# EAGLE design nucleo_controller (EAGLE 9.4.2)

## Sheet 1 of 2
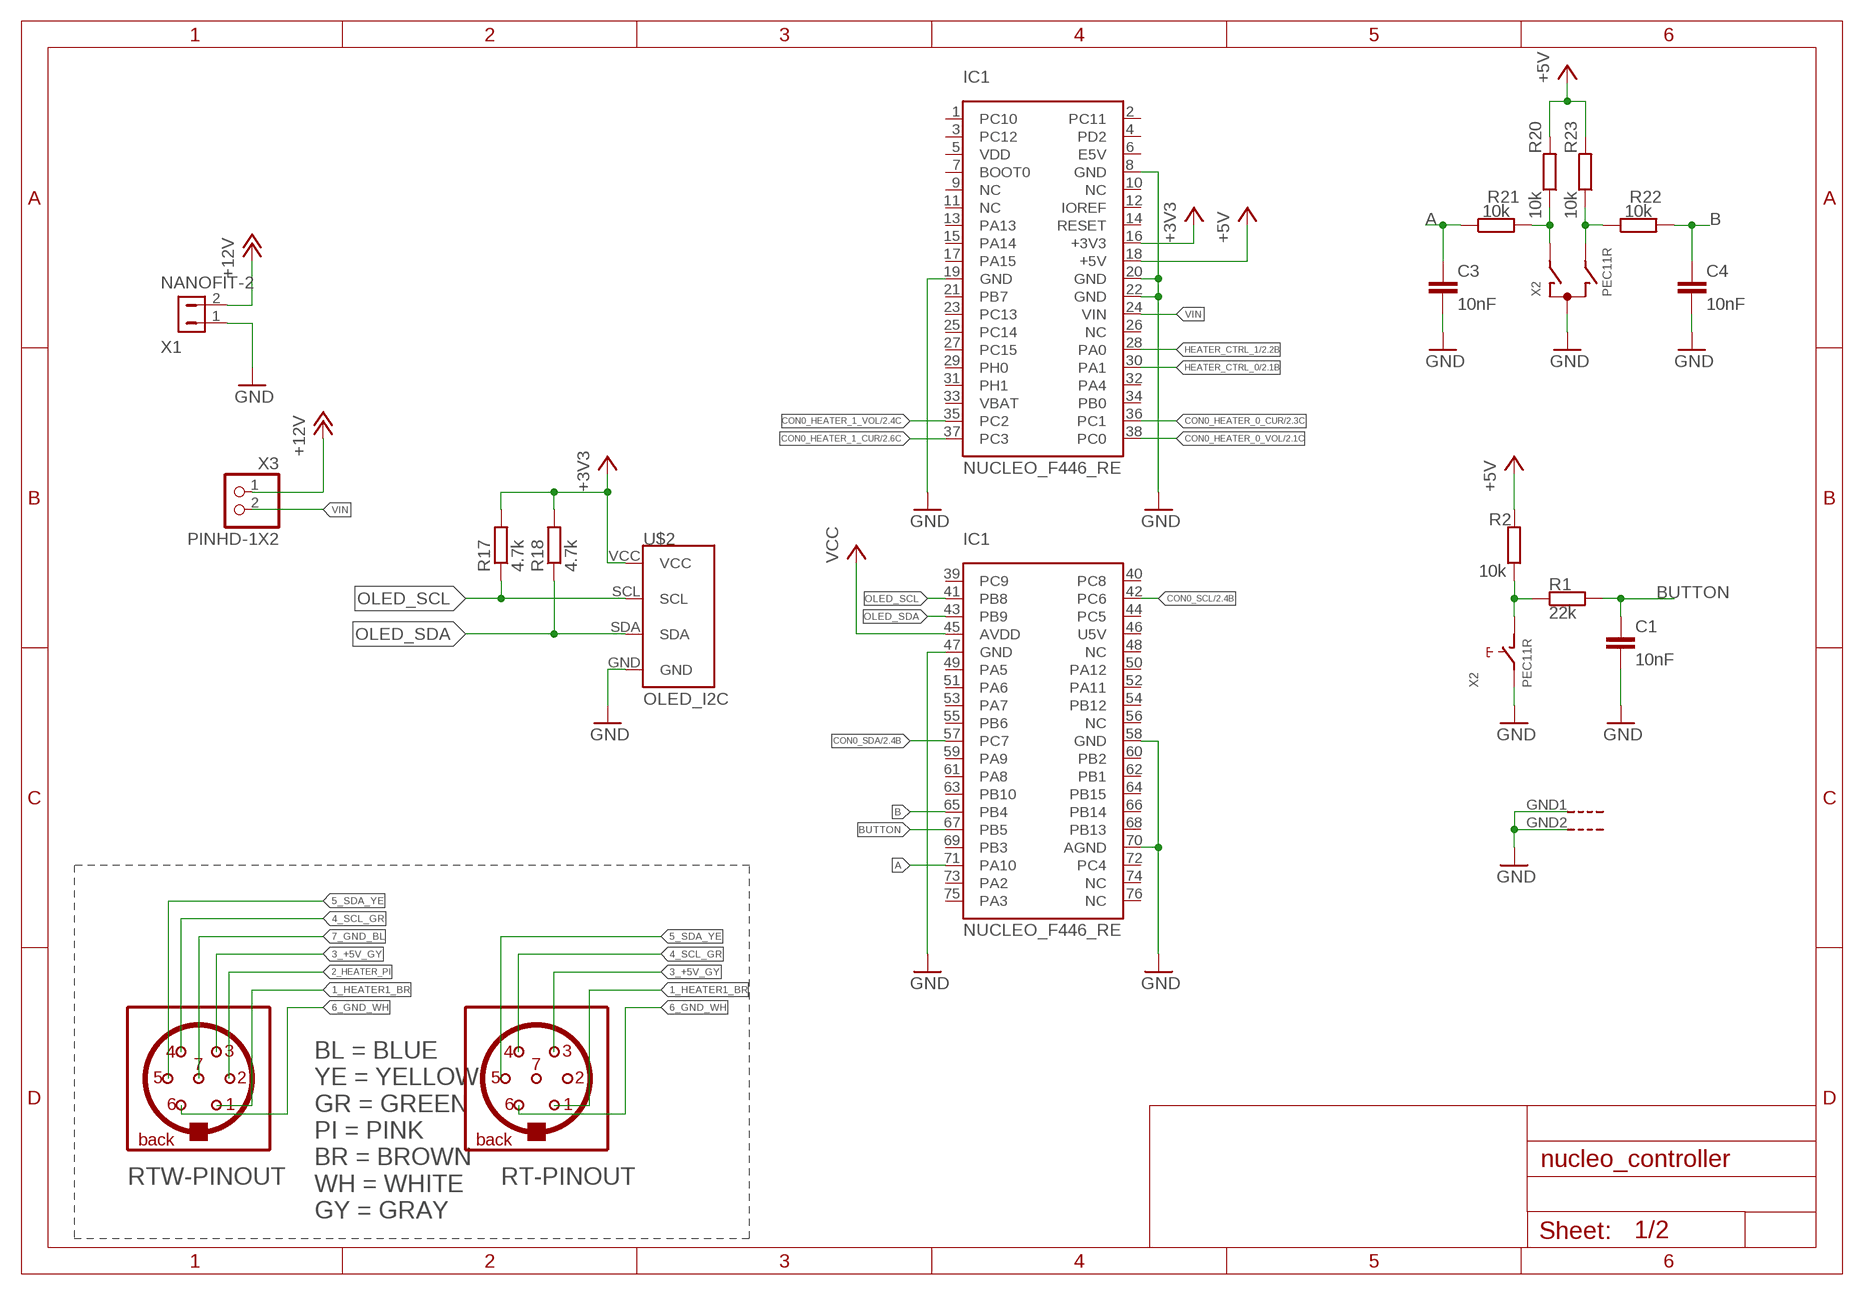
[diagram p0: schematic, sheet 1]

### Parts
C1  10nF  C-EUC0805  [C0805]
C3  10nF  C-EUC0805  [C0805]
C4  10nF  C-EUC0805  [C0805]
CON1  BINDER-IP40  (no package)
CON2  BINDER-IP40  (no package)
IC1  NUCLEO_F446_RE  [NUCLEO_F446_RE]
R1  22k  R-EU_R0805  [R0805]
R2  10k  R-EU_R0805  [R0805]
R17  4.7k  R-EU_R0603  [R0603]
R18  4.7k  R-EU_R0603  [R0603]
R20  10k  R-EU_R0805  [R0805]
R21  10k  R-EU_R0805  [R0805]
R22  10k  R-EU_R0805  [R0805]
R23  10k  R-EU_R0805  [R0805]
U$2  OLED_I2C  [OLED_I2C]
X1  NANOFIT-2  [NANOFIT-2-90]
X2  PEC11R  [PEC11R]
X3  PINHD-1X2  [1X02]

### Nets
1_HEATER1_BR: CON1.P$4 CON2.P$4
2_HEATER_PI: CON1.P$2
3_+5V_GY: CON1.P$3 CON2.P$3
4_SCL_GR: CON1.P$6 CON2.P$6
5_SDA_YE: CON1.P$7
6_GND_WH: CON1.P$5 CON2.P$5
7_GND_BL: CON1.P$1
+3V3: IC1.16(+3V3) R17.2 R18.2 U$2.VCC
+5V: IC1.18(+5V) R2.2 R20.2 R23.2 ; also sheet 2
+12V: X1.2 X3.1 ; also sheet 2
A: C3.1 IC1.71(PA10) R21.1
A_UNFIL: R20.1 R21.2 X2.A
B: C4.1 IC1.65(PB4) R22.2
B_UNFIL: R22.1 R23.1 X2.B
BUTTON: C1.1 IC1.67(PB5) R1.2
BUTTON_UNFIL: R1.1 R2.1 X2.D
CON0_HEATER_0_CUR: IC1.36(PC1) ; also sheet 2
CON0_HEATER_0_VOL: IC1.38(PC0) ; also sheet 2
CON0_HEATER_1_CUR: IC1.37(PC3) ; also sheet 2
CON0_HEATER_1_VOL: IC1.35(PC2) ; also sheet 2
CON0_SCL: IC1.42(PC6) ; also sheet 2
CON0_SDA: IC1.57(PC7) ; also sheet 2
GND: C1.2 C3.2 C4.2 IC1.8(GND) IC1.19(GND) IC1.20(GND) IC1.22(GND) IC1.47(GND) IC1.58(GND) IC1.70(AGND) U$2.GND X1.1 X2.C X2.E X2.GND1(G) X2.GND2(G) ; also sheet 2
HEATER_CTRL_0: IC1.30(PA1) ; also sheet 2
HEATER_CTRL_1: IC1.28(PA0) ; also sheet 2
OLED_SCL: IC1.41(PB8) R17.1 U$2.SCL
OLED_SDA: IC1.43(PB9) R18.1 U$2.SDA
VCC: IC1.45(AVDD) ; also sheet 2
VIN: IC1.24(VIN) X3.2
Unconnected: CON2.P$1 CON2.P$2 CON2.P$7 IC1.1(PC10) IC1.2(PC11) IC1.3(PC12) IC1.4(PD2) IC1.5(VDD) IC1.6(E5V) IC1.7(BOOT0) IC1.9(NC) IC1.10(NC) IC1.11(NC) IC1.12(IOREF) IC1.13(PA13) IC1.14(RESET) IC1.15(PA14) IC1.17(PA15) IC1.21(PB7) IC1.23(PC13) IC1.25(PC14) IC1.26(NC) IC1.27(PC15) IC1.29(PH0) IC1.31(PH1) IC1.32(PA4) IC1.33(VBAT) IC1.34(PB0) IC1.39(PC9) IC1.40(PC8) IC1.44(PC5) IC1.46(U5V) IC1.48(NC) IC1.49(PA5) IC1.50(PA12) IC1.51(PA6) IC1.52(PA11) IC1.53(PA7) IC1.54(PB12) IC1.55(PB6) IC1.56(NC) IC1.59(PA9) IC1.60(PB2) IC1.61(PA8) IC1.62(PB1) IC1.63(PB10) IC1.64(PB15) IC1.66(PB14) IC1.68(PB13) IC1.69(PB3) IC1.72(PC4) IC1.73(PA2) IC1.74(NC) IC1.75(PA3) IC1.76(NC)

### Notes on the sheet
- BL = BLUE
  YE = YELLOW
  GR = GREEN
  PI = PINK
  BR = BROWN
  WH = WHITE
  GY = GRAY
- RTW-PINOUT | RT-PINOUT

## Sheet 2 of 2
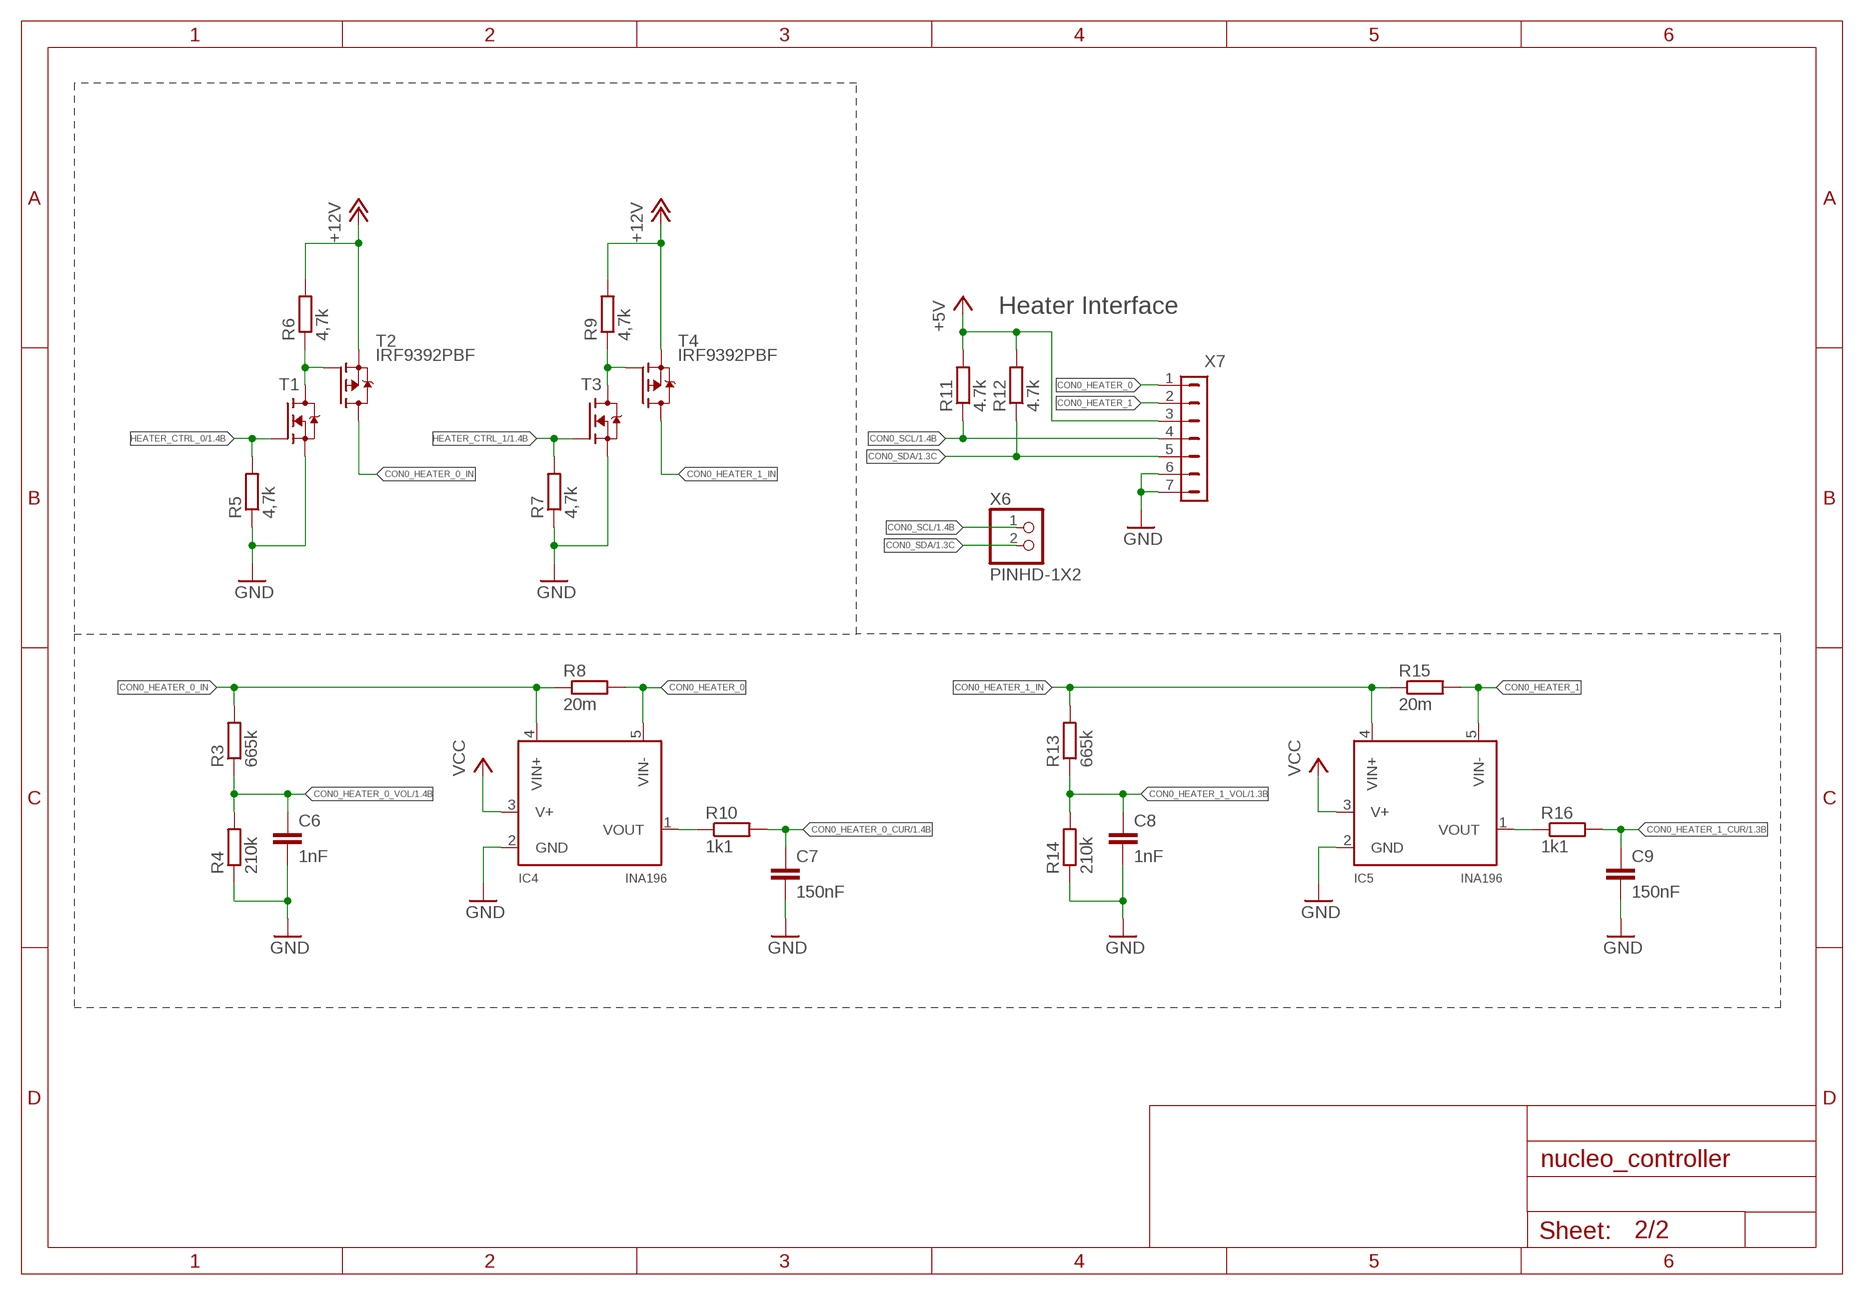
[diagram p1: schematic, sheet 2]

### Parts
C6  1nF  C-EUC0603  [C0603]
C7  150nF  C-EUC0603  [C0603]
C8  1nF  C-EUC0603  [C0603]
C9  150nF  C-EUC0603  [C0603]
IC4  INA196  [SOT23-5L]
IC5  INA196  [SOT23-5L]
R3  665k  R-EU_R0603  [R0603]
R4  210k  R-EU_R0603  [R0603]
R5  4,7k  R-EU_R0805  [R0805]
R6  4,7k  R-EU_R0805  [R0805]
R7  4,7k  R-EU_R0805  [R0805]
R8  20m  R-EU_R1206  [R1206]
R9  4,7k  R-EU_R0805  [R0805]
R10  1k1  R-EU_R0603  [R0603]
R11  4.7k  R-EU_R0603  [R0603]
R12  4.7k  R-EU_R0603  [R0603]
R13  665k  R-EU_R0603  [R0603]
R14  210k  R-EU_R0603  [R0603]
R15  20m  R-EU_R1206  [R1206]
R16  1k1  R-EU_R0603  [R0603]
T1  NVR4003NT3G  [SOT23]
T2  IRF9392PBF  [SO8]
T3  NVR4003NT3G  [SOT23]
T4  IRF9392PBF  [SO8]
X6  PINHD-1X2  [1X02]
X7  NANOFIT-7  [NANOFIT-7]

### Nets
+5V: R11.2 R12.2 X7.3 ; also sheet 1
+12V: R6.2 R9.2 T2.1(S) T2.2(S) T2.3(S) T4.1(S) T4.2(S) T4.3(S) ; also sheet 1
CON0_HEATER_0: IC4.5(VIN-) R8.2 X7.1
CON0_HEATER_0_CUR: C7.1 R10.2 ; also sheet 1
CON0_HEATER_0_IN: IC4.4(VIN+) R3.2 R8.1 T2.5(D) T2.6(D) T2.7(D) T2.8(D)
CON0_HEATER_0_VOL: C6.1 R3.1 R4.2 ; also sheet 1
CON0_HEATER_1: IC5.5(VIN-) R15.2 X7.2
CON0_HEATER_1_CUR: C9.1 R16.2 ; also sheet 1
CON0_HEATER_1_IN: IC5.4(VIN+) R13.2 R15.1 T4.5(D) T4.6(D) T4.7(D) T4.8(D)
CON0_HEATER_1_VOL: C8.1 R13.1 R14.2 ; also sheet 1
CON0_SCL: R11.1 X6.1 X7.4 ; also sheet 1
CON0_SDA: R12.1 X6.2 X7.5 ; also sheet 1
GND: C6.2 C7.2 C8.2 C9.2 IC4.2(GND) IC5.2(GND) R4.1 R5.1 R7.1 R14.1 T1.2(S) T3.2(S) X7.6 X7.7 ; also sheet 1
HEATER0_AD_OUT0: IC4.1(VOUT) R10.1
HEATER0_AD_OUT1: IC5.1(VOUT) R16.1
HEATER0_G0: R6.1 T1.3(D) T2.4(G)
HEATER0_G1: R9.1 T3.3(D) T4.4(G)
HEATER_CTRL_0: R5.2 T1.1(G) ; also sheet 1
HEATER_CTRL_1: R7.2 T3.1(G) ; also sheet 1
VCC: IC4.3(V+) IC5.3(V+) ; also sheet 1

### Notes on the sheet
- Heater Interface

## Library data of the parts
C1 C3 C4 = rcl:C-EU: CAPACITOR, European symbol; SPICEPREFIX: C
C6 C8 = rcl:C-EU: CAPACITOR, European symbol; OC_MOUSER: 710-885012206059; SPICEPREFIX: C
C7 C9 = rcl:C-EU: CAPACITOR, European symbol; OC_MOUSER: 810-C1608X5R1E154K; SPICEPREFIX: C
CON1 CON2 = solderpi:BINDER-IP40
IC1 = solderpi:NUCLEO_F446_RE
IC4 IC5 = solderpi:INA196; OC_MOUSER: 595-INA196AIDBVT
R1 R2 R20-R23 = rcl:R-EU_: RESISTOR, European symbol; SPICEPREFIX: R
R3 R13 = rcl:R-EU_: RESISTOR, European symbol; OC_MOUSER: 71-CRCW0603-665K-E3; SPICEPREFIX: R
R4 R14 = rcl:R-EU_: RESISTOR, European symbol; OC_MOUSER: 603-RC0603FR-10220KL; SPICEPREFIX: R
R5-R7 R9 = rcl:R-EU_: RESISTOR, European symbol; OC_MOUSER: 652-CR0805-FX4701GLF; SPICEPREFIX: R
R8 R15 = rcl:R-EU_: RESISTOR, European symbol; OC_DIGIKEY: https://www.digikey.de/product-detail/de/stackpole-electronics-inc/CSRN2010FK20L0/CSRN2010FK20L0CT-ND/1646246; SPICEPREFIX: R
R10 R16 = rcl:R-EU_: RESISTOR, European symbol; OC_MOUSER: 603-AC0603FR-071K1L; SPICEPREFIX: R
R11 R12 R17 R18 = rcl:R-EU_: RESISTOR, European symbol; OC_MOUSER: 603-RC0603FR-0710KL; SPICEPREFIX: R
T1 T3 = solderpi:NVR4003NT3G; OC_MOUSER: 863-NVR4003NT3G
T2 T4 = solderpi:IRF9392PBF; OC_MOUSER: 942-IRF9392TRPBF
U$2 = solderpi:OLED_I2C
X1 = solderpi:NANOFIT-2
X2 = solderpi:PEC11R
X3 X6 = solderpi:PINHD-1X2: PIN HEADER; OC_MOUSER: 855-M20-9990246
X7 = solderpi:NANOFIT-7; OC_MOUSER: 538-105313-1107, 538-105307-1207

## Net classes
0 µC: width 0.2 mm, drill 0.3 mm, clearance 0.25 mm
1 +12V: width 0.4 mm, drill 0.35 mm, clearance 0.3 mm

## Board
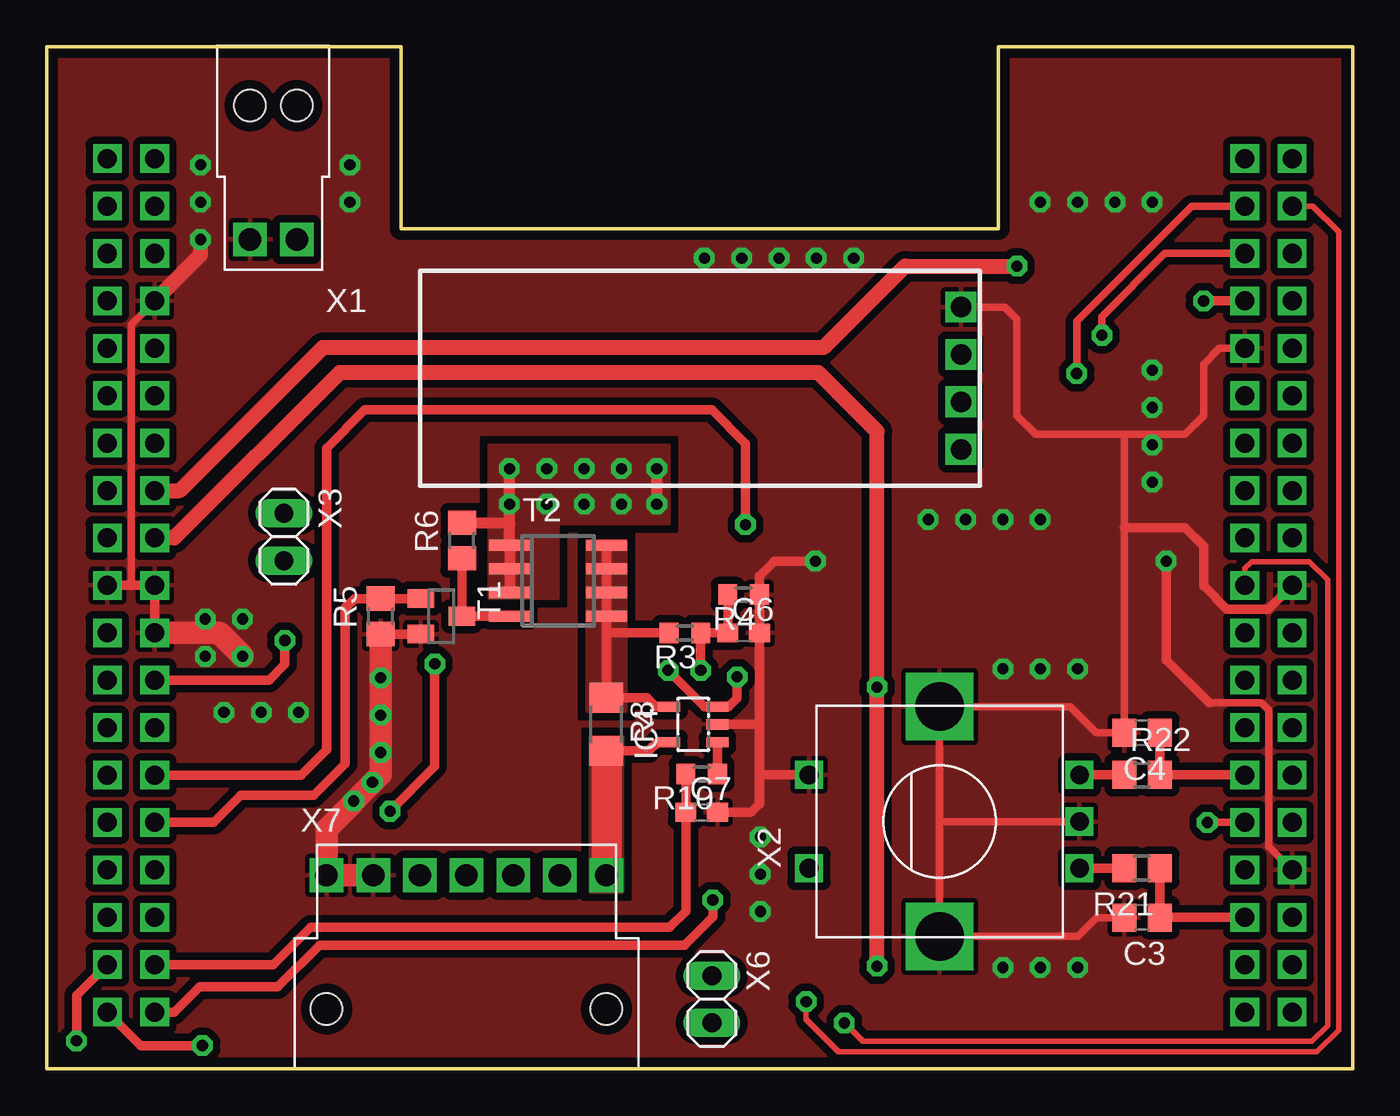
[diagram p2: board, top side]
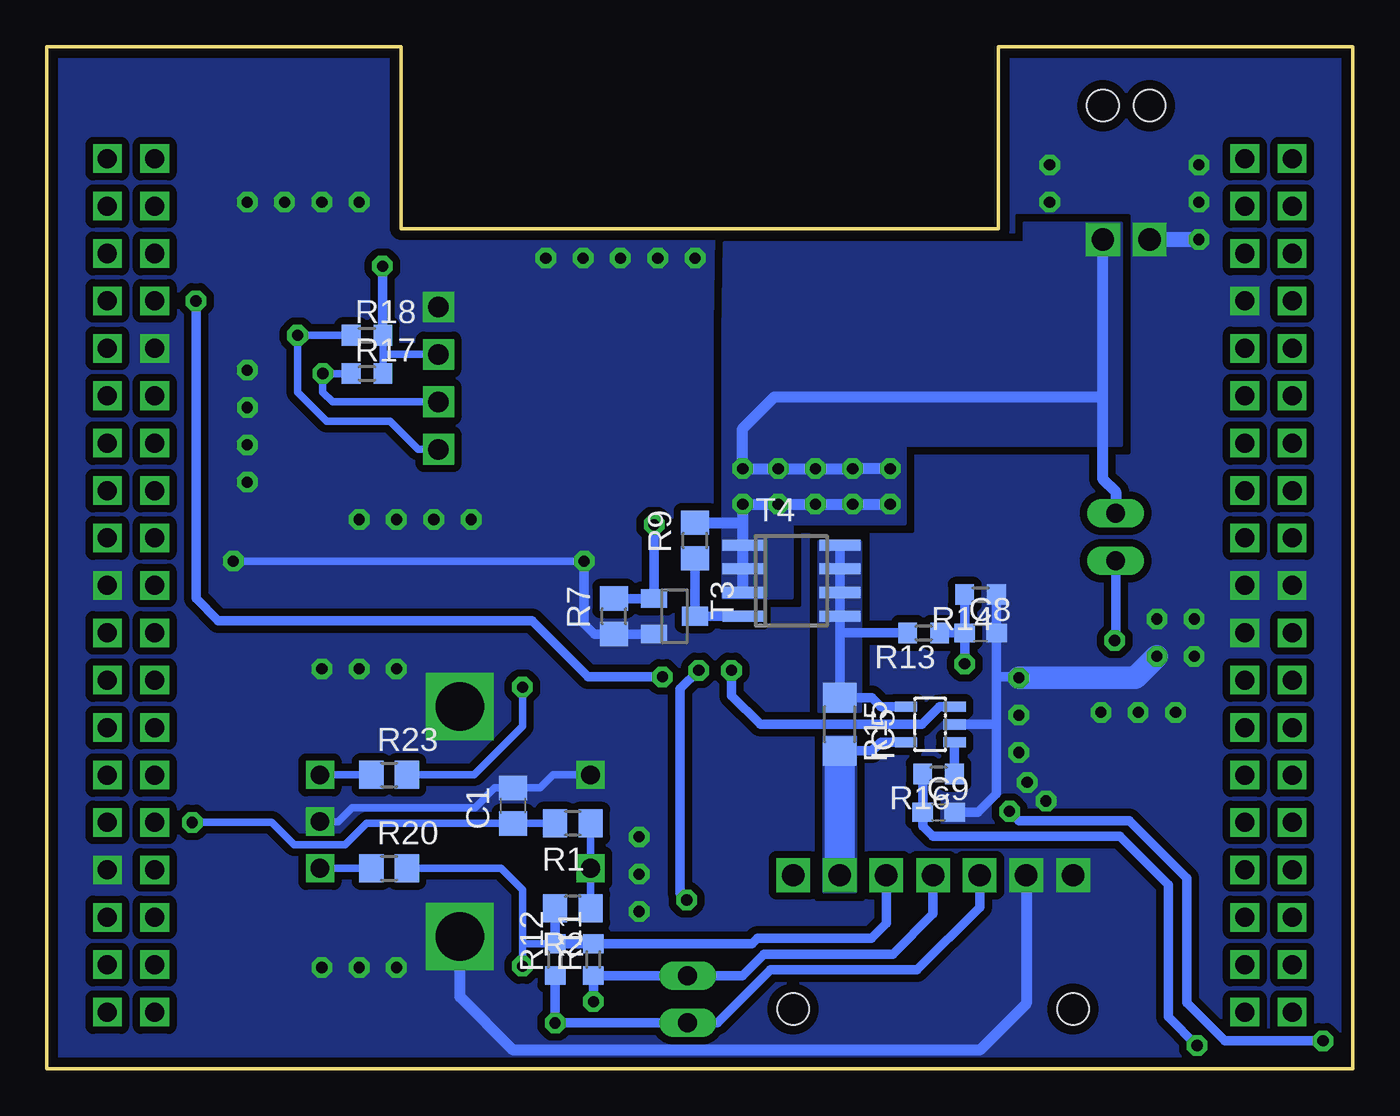
[diagram p3: board, bottom side, seen from below]

Size 70 x 54.76 mm. Coordinates in mm from the lower left corner, seen from the top.
Outline: 0,0 0,54.76 19,54.76 19,45 51,45 51,54.76 70,54.76 70,0 0,0
Copper layers (1*16): Top 0.035mm / dielectric 1.5mm / Bottom 0.035mm
Design rules "default *": minimum track width 6mil, minimum drill 0.35mm, track to track 6mil, track to pad 6mil, pad to pad 6mil, via to via 6mil, smd to smd 6mil, copper to edge 20mil, drill to drill 6mil, minimum pad ring 10mil, minimum via ring 8mil, stop-mask expansion 4mil, vias tented up to drill 0mil, thermal gap 10mil

### Footprints (pad centres in the part's own frame; a part is rotated, then mirrored left to right if it is on the bottom)
C0805 = smd 1.3 x 1.5: 1 -0.95,0; 2 0.95,0
C0603 = smd 1.1 x 1: 1 -0.85,0; 2 0.85,0
NUCLEO_F446_RE = drill 1.02 square: 1 3.25,48.76; 2 5.79,48.76; 3 3.25,46.22; 4 5.79,46.22; 5 3.25,43.68; 6 5.79,43.68; 7 3.25,41.14; 8 5.79,41.14; 9 3.25,38.6; 10 5.79,38.6; 11 3.25,36.06; 12 5.79,36.06; 13 3.25,33.52; 14 5.79,33.52; 15 3.25,30.98; 16 5.79,30.98; 17 3.25,28.44; 18 5.79,28.44; 19 3.25,25.9; 20 5.79,25.9; 21 3.25,23.36; 22 5.79,23.36; 23 3.25,20.82; 24 5.79,20.82; 25 3.25,18.28; 26 5.79,18.28; 27 3.25,15.74; 28 5.79,15.74; 29 3.25,13.2; 30 5.79,13.2; 31 3.25,10.66; 32 5.79,10.66; 33 3.25,8.12; 34 5.79,8.12; 35 3.25,5.58; 36 5.79,5.58; 37 3.25,3.04; 38 5.79,3.04; 39 64.21,48.76; 40 66.75,48.76; 41 64.21,46.22; 42 66.75,46.22; 43 64.21,43.68; 44 66.75,43.68; 45 64.21,41.14; 46 66.75,41.14; 47 64.21,38.6; 48 66.75,38.6; 49 64.21,36.06; 50 66.75,36.06; 51 64.21,33.52; 52 66.75,33.52; 53 64.21,30.98; 54 66.75,30.98; 55 64.21,28.44; 56 66.75,28.44; 57 64.21,25.9; 58 66.75,25.9; 59 64.21,23.36; 60 66.75,23.36; 61 64.21,20.82; 62 66.75,20.82; 63 64.21,18.28; 64 66.75,18.28; 65 64.21,15.74; 66 66.75,15.74; 67 64.21,13.2; 68 66.75,13.2; 69 64.21,10.66; 70 66.75,10.66; 71 64.21,8.12; 72 66.75,8.12; 73 64.21,5.58; 74 66.75,5.58; 75 64.21,3.04; 76 66.75,3.04
SOT23-5L = smd 0.55 x 1.2: 1 -0.95,-1.3; 2 0,-1.3; 3 0.95,-1.3; 4 0.95,1.3; 5 -0.95,1.3
R0805 = smd 1.3 x 1.5: 1 -0.95,0; 2 0.95,0
R0603 = smd 1 x 1.1: 1 -0.85,0; 2 0.85,0
R1206 = smd 1.6 x 1.803: 1 -1.422,0; 2 1.422,0
SOT23 = smd 1 x 1.4: 1 -0.95,-1.1; 2 0.95,-1.1; 3 0,1.1
SO8 = smd 0.6 x 2.2: 1 -1.905,-2.6; 2 -0.635,-2.6; 3 0.635,-2.6; 4 1.905,-2.6; 5 1.905,2.6; 6 0.635,2.6; 7 -0.635,2.6; 8 -1.905,2.6
OLED_I2C = drill 1.1 square: GND 0,-3.81; SCL 0,1.27; SDA 0,3.81; VCC 0,-1.27
NANOFIT-2-90 = drill 1.2 square: 1 1.25,10.37; 2 -1.25,10.37 | hole 1.7: -1.25,3.2; 1.25,3.2
PEC11R = drill 1 square: A -2.5,-7.5; B 2.5,-7.5; C 0,-7.5; D -2.5,7; E 2.5,7 | drill 2.6 square: GND1 -6.15,0; GND2 6.15,0
1X02 = drill 1.016 long: 1 -1.27,0; 2 1.27,0
NANOFIT-7 = drill 1.2 square: 1 7.5,10.37; 2 5,10.37; 3 2.5,10.37; 4 0,10.37; 5 -2.5,10.37; 6 -5,10.37; 7 -7.5,10.37 | hole 1.7: -7.5,3.2; 7.5,3.2

### Placement (x,y rotation side)
C1  45,14.1 90 bottom
C3  58.7,8.1 180 top
C4  58.7,18 180 top
C6  37.35,23.35 0 top
C7  35.1,13.75 0 top
C8  19.95,23.35 0 bottom
C9  22.2,13.75 0 bottom
IC1  0,0 0 top
IC4  34.65,18.45 90 top
IC5  22.65,18.45 90 bottom
R1  41.8,13.15 180 bottom
R2  41.8,8.6 180 bottom
R3  34.2,23.35 180 top
R4  37.35,25.4 180 top
R5  17.9,24.25 90 top
R6  22.25,28.3 90 top
R7  39.6,24.25 90 bottom
R8  30,18.45 270 top
R9  35.25,28.3 90 bottom
R10  35.1,15.8 180 top
R11  40.7,5.85 90 bottom
R12  42.75,5.85 90 bottom
R13  23,23.35 180 bottom
R14  19.95,25.4 180 bottom
R15  27.5,18.45 270 bottom
R16  22.2,15.8 180 bottom
R17  52.83,37.25 0 bottom
R18  52.83,39.3 0 bottom
R20  51.65,10.75 0 bottom
R21  58.7,10.75 180 top
R22  58.7,15.75 0 top
R23  51.65,15.75 0 bottom
T1  21.15,24.25 270 top
T2  27.41,26.15 270 top
T3  36.35,24.25 270 bottom
T4  30.09,26.15 270 bottom
U$2  49,37 180 top
X1  12.15,54.8 180 top
X2  47.85,13.25 90 top
X3  12.71,28.5 270 top
X6  35.65,3.73 270 top
X7  22.5,0 0 top

### Tracks (layer width: path | path; a pad name or v marks a point on that pad's centre or on a via)
+3V3  (via drill 0.6 pad 1.1)
  Top 0.8: IC1.16 7.14,30.98 14.81,38.65 41.65,38.65 46,43 v52,43
  Bottom 0.4: U$2.VCC 51.98,38.27 | R17.2 51.98,38.27 | 51.98,38.27 R18.2
  Bottom 0.5: v52,43 52,39.32 R18.2
+5V  (via drill 0.6 pad 1.1)
  Top 0.8: v44.5,5.5 v44.5,20.45 44.5,34.15 41.35,37.3 15.7,37.3 6.84,28.44 IC1.18
  Bottom 0.4: R12.2 44.5,6.7 | R23.2 47.1,15.75 44.5,18.35 v44.5,20.45 | R20.2 45.65,10.75 44.5,9.6 44.5,6.7 | 44.5,6.7 v44.5,5.5
  Bottom 0.5: X7.3 25,7.8 25.8,7 31.9,7 32.2,6.7 R11.2 R12.2 R2.2
+12V  (via drill 0.6 pad 1.1)
  Top 0.6: 24.81,29.25 T2.1 T2.2 T2.3 | R6.2 24.81,29.25 | v32.7,30.25 v32.7,32.15 | v24.8,32.15 v24.8,30.25 v24.81,30.25 24.81,29.25
  Bottom 0.6: 32.69,29.25 T4.1 T4.2 T4.3 | 13.41,36 31,36 32.69,34.31 32.7,34.31 v32.7,32.15 v30.8,32.15 v28.8,32.15 v26.8,32.15 v24.8,32.15 | R9.2 32.69,29.25 | 32.69,29.25 v32.69,30.25 v32.7,30.25 v30.8,30.25 v28.8,30.25 v26.8,30.25 v24.8,30.25 | X1.2 13.41,44.42 13.41,36 | X3.1 12.71,30.92 13.41,31.62 13.41,36
  pour Top (no thermals): 23.7,25.2 27.4,25.2 27.4,29.2 33.35,29.2 33.35,33.4 23.7,33.4
  pour Bottom (no thermals): 33.75,25.25 33.75,39.45 33.68,44.25 17.6,44.25 17.6,45.3 12.4,45.3 12.4,33.4 24,33.4 24,29.2 30.05,29.2 30.05,25.25
A
  Top 0.5: R21.1 C3.1 59.67,8.12 IC1.71
A_UNFIL
  Top 0.5: X2.A R21.2
  Bottom 0.4: R20.1 X2.A
B
  Top 0.5: C4.1 R22.2 IC1.65
B_UNFIL
  Top 0.5: R22.1 X2.B
  Bottom 0.4: X2.B R23.1
BUTTON  (via drill 0.6 pad 1.1)
  Top 0.4: v62.2,13.2 IC1.67
  Bottom 0.4: v62.2,13.2 57.95,13.2 56.75,12 54,12 52.85,13.15 C1.1 R1.2
BUTTON_UNFIL
  Bottom 0.4: R1.1 X2.D R2.1
CON0_HEATER_0
  Top 0.5: R8.2 32.26,17.03 32.73,17.5 IC4.5
  Top 1.6: R8.2 X7.1
  pour Top (no thermals): 29.15,17.8 30.85,17.8 30.85,9.5 29.15,9.5
CON0_HEATER_0_CUR
  Top 0.5: R10.2 C7.1 34.25,8.45 33.38,7.58 14.14,7.58 12.14,5.58 IC1.36
CON0_HEATER_0_IN
  Top 0.5: T2.8 T2.7 T2.6 T2.5 30.01,23.35 | IC4.4 32.65,19.4 32.18,19.87 R8.1 30.01,23.35 | R3.2 30.01,23.35
  pour Top (no thermals): 28.95,28.25 28.95,19.15 31.05,19.15 31.05,28.25
CON0_HEATER_0_VOL  (via drill 0.6 pad 1.1)
  Top 0.5: IC1.38 6.84,3.04 8.19,4.39 12.39,4.39 14.63,6.63 34.19,6.63 35.7,8.14 v35.7,9.05 | v35.05,21.35 R3.1 C6.1 R4.2
  Bottom 0.5: v35.7,9.05 36.05,9.4 36.05,20.35 v35.05,21.35
CON0_HEATER_1
  Bottom 0.5: IC5.5 25.3,17.5 25.77,17.03 R15.2
  Bottom 1.6: X7.2 R15.2
  pour Bottom (no thermals): 26.65,17.8 28.35,17.8 28.35,9.5 26.65,9.5
CON0_HEATER_1_CUR  (via drill 0.6 pad 1.1)
  Top 0.5: IC1.37 5.04,1.25 v8.35,1.25
  Bottom 0.5: R16.2 C9.1 23.05,13 22.5,12.45 12.5,12.45 9.9,9.85 9.9,2.8 v8.35,1.25
CON0_HEATER_1_IN
  Bottom 0.5: 27.49,23.35 27.49,20.66 R15.1 25.77,19.87 25.3,19.4 IC5.4 | 27.49,23.35 T4.5 T4.6 T4.7 T4.8 | R13.2 27.49,23.35
  pour Bottom (no thermals): 26.4,19.15 28.6,19.15 28.6,28.25 26.4,28.25
CON0_HEATER_1_VOL  (via drill 0.6 pad 1.1)
  Top 0.5: IC1.35 1.6,3.93 v1.6,1.5 | v18.4,13.8 20.8,16.2 v20.8,21.7
  Bottom 0.5: v1.6,1.5 6.85,1.5 8.9,3.55 8.9,10.21 11.99,13.3 17.9,13.3 v18.4,13.8 | v20.8,21.7 C8.1 | C8.1 R14.2 | R13.1 C8.1
CON0_SCL  (via drill 0.6 pad 1.1)
  Top 0.3: IC1.42 67.85,46.22 69.23,44.84 69.23,2.08 68.07,0.92 42.43,0.92 40.7,2.65 v40.7,3.6
  Bottom 0.5: X7.4 22.5,8.3 24.65,6.15 31.56,6.15 32.71,5 X6.1 R11.1 v40.7,3.6
CON0_SDA  (via drill 0.6 pad 1.1)
  Top 0.3: IC1.57 64.21,26.81 64.58,27.18 67.67,27.18 68.65,26.2 68.65,2.31 67.81,1.48 43.73,1.48 v42.75,2.46
  Bottom 0.5: X7.5 20,8.65 23.35,5.3 31.2,5.3 34.04,2.46 X6.2 v42.75,2.46 R12.1
GND  (via drill 0.6 pad 1.1)
  Top 0.4: C3.2 56.25,8.1 55.25,7.1 X2.GND1 47.85,13.25 | X2.C 47.85,13.25 | 47.85,13.25 X2.GND2 54.85,19.4 56.25,18 C4.2 57.75,29 57.75,34 | 57.75,34 53,34 52,35 52,40.15 51.34,40.81 U$2.GND | IC1.8 4.53,39.88 4.53,25.9 | 57.75,34 61,34 62,35 62,37.75 62.85,38.6 IC1.47 | 62.3,19.6 65.1,19.6 65.5,19.2 65.5,11.91 IC1.70
  Top 0.5: R5.1 T1.2 | IC1.19 4.53,25.9 IC1.20 IC1.22 | IC1.58 65.47,24.62 63.25,24.62 62,25.87 62,28 61,29 57.75,29 | 38.2,18.45 C6.2 R4.1 38.2,26.4 39,27.2 v41.2,27.2 | 38.2,18.45 38.2,15.75 | 38.2,15.75 38.2,14.2 37.75,13.75 C7.2 | 62.3,19.6 60,21.9 v60,27.2 | IC4.2 38.2,18.45 | X2.E 38.2,15.75
  Top 0.8: IC1.8 8.25,43.6 v8.25,44.43
  Top 1.2: R5.1 v17.9,20.95 17.9,15.74 15,12.84 X7.7 X7.6 | IC1.22 9.24,23.36 v10.5,22.1
  Bottom 0.4: X2.C 54.37,13.25 53.62,14 47.05,14 46,15.05 C1.2 43.55,15.05 42.85,15.75 X2.E | v60,27.2 v41.2,27.2
  Bottom 0.5: R14.1 C8.2 19.1,21 | C9.2 20.1,13.75 19.1,14.75 19.1,18.45 | 19.1,18.45 IC5.2 | 19.1,18.45 19.1,21 | v17.9,20.95 17.9,21 19.1,21 | T3.2 R7.1 40.65,23.3 41.2,23.85 v41.2,27.2
  Bottom 0.6: X7.6 17.5,3.5 20,1 45,1 47.85,3.85 X2.GND1
  Bottom 0.8: X1.1 v8.25,44.43
  Bottom 1.2: v17.9,20.95 11.65,20.95 v10.5,22.1
  other vias: 8.25,46.43 8.25,48.43 16.25,46.43 16.25,48.43 35.25,43.43 37.25,43.43 39.25,43.43 41.25,43.43 43.25,43.43 53.25,46.43 55.25,46.43 57.25,46.43 59.25,46.43 59.25,37.43 59.25,35.43 59.25,33.43 59.25,31.43 47.25,29.43 49.25,29.43 51.25,29.43 53.25,29.43 38.25,12.43 38.25,10.43 38.25,8.43 17.9,18.95 17.9,16.95 51.25,21.43 53.25,21.43 55.25,21.43 51.25,5.43 53.25,5.43 55.25,5.43 8.5,22.1 8.5,24.1 10.5,24.1 13.5,19.1 11.5,19.1 9.5,19.1 17.45,15.35 16.45,14.35
  pour Bottom (isolate 0.406, rank 2, no thermals): 0,54.76 0,0 70,0 70,54.76 51,54.76 51,45 19,45 19,54.76
  pour Top (isolate 0.406, rank 2): 0,54.76 0,0 70,0 70,54.76 51,54.76 51,45 19,45 19,54.76
HEATER0_AD_OUT0
  Top 0.5: R10.1 IC4.1
HEATER0_AD_OUT1
  Bottom 0.5: R16.1 IC5.1
HEATER0_G0
  Top 0.5: R6.1 T1.3 T2.4
HEATER0_G1
  Bottom 0.5: R9.1 T3.3 T4.4
HEATER_CTRL_0
  Top 0.5: T1.1 R5.2 16.5,25.2 16,24.7 16,16.35 14.3,14.65 10.39,14.65 8.94,13.2 IC1.30
HEATER_CTRL_1  (via drill 0.6 pad 1.1)
  Top 0.5: v37.45,29.15 37.45,33.5 35.65,35.3 17.05,35.3 15,33.25 15,17.1 13.64,15.74 IC1.28
  Bottom 0.5: R7.2 T3.1 v37.45,29.15
OLED_SCL  (via drill 0.6 pad 1.1)
  Top 0.4: v55.2,37.25 55.2,40.05 61.37,46.22 IC1.41
  Bottom 0.4: R17.1 v55.2,37.25 55.2,36.25 54.68,35.73 U$2.SCL
OLED_SDA  (via drill 0.6 pad 1.1)
  Top 0.4: v56.55,39.3 56.55,40.3 59.93,43.68 IC1.43
  Bottom 0.4: R18.1 v56.55,39.3 56.55,36.25 54.99,34.69 51.6,34.69 50.1,33.19 U$2.SDA
VCC  (via drill 0.6 pad 1.1)
  Top 0.5: v37,21 37,19.85 36.55,19.4 IC4.3 35.25,19.4 v33.3,21.35 | IC1.45 v62,41.14
  Bottom 0.5: v37,21 41,21 44,24 60.8,24 62,25.2 v62,41.14 | IC5.3 22.15,19.4 23.1,18.45 31.75,18.45 33.3,20 v33.3,21.35
VIN  (via drill 0.6 pad 1.1)
  Top 0.5: IC1.24 11.92,20.82 12.76,21.66 v12.76,22.95
  Bottom 0.5: X3.2 12.71,23 v12.76,22.95